# Altium schematic sheet TOP.SchDoc
size A4
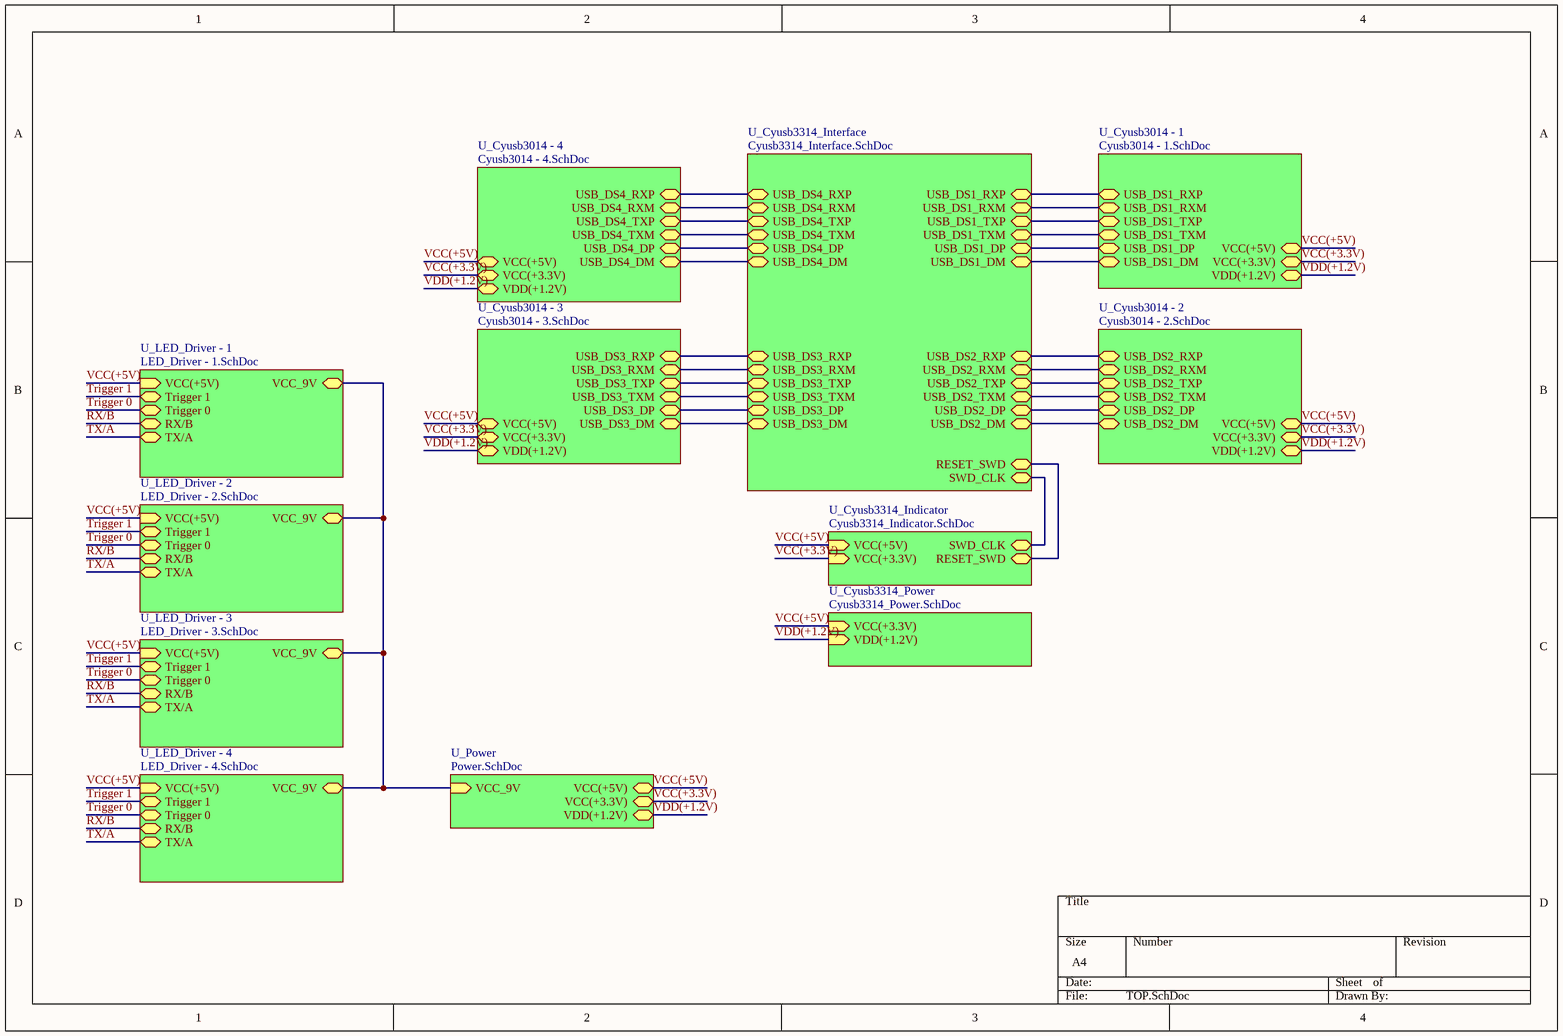
[diagram p0: TOP.SchDoc]

## Sub-sheets
U_Cyusb3014 - 1 = Cyusb3014 - 1.SchDoc: USB_DS1_RXP (bidir), USB_DS1_RXM (bidir), USB_DS1_TXP (bidir), USB_DS1_TXM (bidir), USB_DS1_DP (bidir), USB_DS1_DM (bidir), VCC(+5V) (bidir), VCC(+3.3V) (bidir), VDD(+1.2V) (bidir)
U_Cyusb3014 - 2 = Cyusb3014 - 2.SchDoc: USB_DS2_RXP (bidir), USB_DS2_RXM (bidir), USB_DS2_TXP (bidir), USB_DS2_TXM (bidir), USB_DS2_DP (bidir), USB_DS2_DM (bidir), VCC(+5V) (bidir), VCC(+3.3V) (bidir), VDD(+1.2V) (bidir)
U_Cyusb3014 - 3 = Cyusb3014 - 3.SchDoc: USB_DS3_RXP (bidir), USB_DS3_RXM (bidir), USB_DS3_TXP (bidir), USB_DS3_TXM (bidir), USB_DS3_DP (bidir), USB_DS3_DM (bidir), VCC(+5V) (bidir), VCC(+3.3V) (bidir), VDD(+1.2V) (bidir)
U_Cyusb3014 - 4 = Cyusb3014 - 4.SchDoc: USB_DS4_RXP (bidir), USB_DS4_RXM (bidir), USB_DS4_TXP (bidir), USB_DS4_TXM (bidir), USB_DS4_DP (bidir), USB_DS4_DM (bidir), VCC(+5V) (bidir), VCC(+3.3V) (bidir), VDD(+1.2V) (bidir)
U_Cyusb3314_Indicator = Cyusb3314_Indicator.SchDoc: SWD_CLK (bidir), RESET_SWD (bidir), VCC(+5V) (in), VCC(+3.3V) (in)
U_Cyusb3314_Interface = Cyusb3314_Interface.SchDoc: RESET_SWD (bidir), SWD_CLK (bidir), USB_DS1_RXP (bidir), USB_DS1_RXM (bidir), USB_DS1_TXP (bidir), USB_DS1_TXM (bidir), USB_DS1_DP (bidir), USB_DS1_DM (bidir), USB_DS2_RXP (bidir), USB_DS2_RXM (bidir), USB_DS2_TXP (bidir), USB_DS2_TXM (bidir), USB_DS2_DP (bidir), USB_DS2_DM (bidir), USB_DS3_RXP (bidir), USB_DS3_RXM (bidir), USB_DS3_TXP (bidir), USB_DS3_TXM (bidir), USB_DS3_DP (bidir), USB_DS3_DM (bidir), USB_DS4_RXP (bidir), USB_DS4_RXM (bidir), USB_DS4_TXP (bidir), USB_DS4_TXM (bidir), USB_DS4_DP (bidir), USB_DS4_DM (bidir)
U_Cyusb3314_Power = Cyusb3314_Power.SchDoc: VCC(+3.3V) (in), VDD(+1.2V) (in)
U_LED_Driver - 1 = LED_Driver - 1.SchDoc: VCC_9V (bidir), VCC(+5V) (in), Trigger 1 (bidir), Trigger 0 (bidir), RX/B (bidir), TX/A (bidir)
U_LED_Driver - 2 = LED_Driver - 2.SchDoc: VCC_9V (bidir), VCC(+5V) (in), Trigger 1 (bidir), Trigger 0 (bidir), RX/B (bidir), TX/A (bidir)
U_LED_Driver - 3 = LED_Driver - 3.SchDoc: VCC_9V (bidir), VCC(+5V) (in), Trigger 1 (bidir), Trigger 0 (bidir), RX/B (bidir), TX/A (bidir)
U_LED_Driver - 4 = LED_Driver - 4.SchDoc: VCC_9V (bidir), VCC(+5V) (in), Trigger 1 (bidir), Trigger 0 (bidir), RX/B (bidir), TX/A (bidir)
U_Power = Power.SchDoc: VCC_9V (in), VCC(+5V) (bidir), VCC(+3.3V) (bidir), VDD(+1.2V) (bidir)

## Nets
RX/B: sheet U_LED_Driver - 1/RX/B, sheet U_LED_Driver - 2/RX/B, sheet U_LED_Driver - 3/RX/B, sheet U_LED_Driver - 4/RX/B
Trigger 0: sheet U_LED_Driver - 1/Trigger 0, sheet U_LED_Driver - 2/Trigger 0, sheet U_LED_Driver - 3/Trigger 0, sheet U_LED_Driver - 4/Trigger 0
Trigger 1: sheet U_LED_Driver - 1/Trigger 1, sheet U_LED_Driver - 2/Trigger 1, sheet U_LED_Driver - 3/Trigger 1, sheet U_LED_Driver - 4/Trigger 1
TX/A: sheet U_LED_Driver - 1/TX/A, sheet U_LED_Driver - 2/TX/A, sheet U_LED_Driver - 3/TX/A, sheet U_LED_Driver - 4/TX/A
VCC(+3.3V): sheet U_Power/VCC(+3.3V), sheet U_Cyusb3014 - 1/VCC(+3.3V), sheet U_Cyusb3014 - 2/VCC(+3.3V), sheet U_Cyusb3014 - 3/VCC(+3.3V), sheet U_Cyusb3014 - 4/VCC(+3.3V), sheet U_Cyusb3314_Indicator/VCC(+3.3V)
VCC(+5V): sheet U_Power/VCC(+5V), sheet U_Cyusb3014 - 1/VCC(+5V), sheet U_Cyusb3014 - 2/VCC(+5V), sheet U_Cyusb3014 - 3/VCC(+5V), sheet U_Cyusb3014 - 4/VCC(+5V), sheet U_Cyusb3314_Indicator/VCC(+5V), sheet U_Cyusb3314_Power/VCC(+3.3V), sheet U_LED_Driver - 1/VCC(+5V), sheet U_LED_Driver - 2/VCC(+5V), sheet U_LED_Driver - 3/VCC(+5V), sheet U_LED_Driver - 4/VCC(+5V)
VDD(+1.2V): sheet U_Power/VDD(+1.2V), sheet U_Cyusb3014 - 1/VDD(+1.2V), sheet U_Cyusb3014 - 2/VDD(+1.2V), sheet U_Cyusb3014 - 3/VDD(+1.2V), sheet U_Cyusb3014 - 4/VDD(+1.2V), sheet U_Cyusb3314_Power/VDD(+1.2V)
(unnamed): sheet U_Power/VCC_9V, sheet U_LED_Driver - 1/VCC_9V, sheet U_LED_Driver - 2/VCC_9V, sheet U_LED_Driver - 3/VCC_9V, sheet U_LED_Driver - 4/VCC_9V
(unnamed): sheet U_Cyusb3014 - 1/USB_DS1_RXP, sheet U_Cyusb3314_Interface/USB_DS1_RXP
(unnamed): sheet U_Cyusb3014 - 1/USB_DS1_RXM, sheet U_Cyusb3314_Interface/USB_DS1_RXM
(unnamed): sheet U_Cyusb3014 - 1/USB_DS1_TXP, sheet U_Cyusb3314_Interface/USB_DS1_TXP
(unnamed): sheet U_Cyusb3014 - 1/USB_DS1_TXM, sheet U_Cyusb3314_Interface/USB_DS1_TXM
(unnamed): sheet U_Cyusb3014 - 1/USB_DS1_DP, sheet U_Cyusb3314_Interface/USB_DS1_DP
(unnamed): sheet U_Cyusb3014 - 1/USB_DS1_DM, sheet U_Cyusb3314_Interface/USB_DS1_DM
(unnamed): sheet U_Cyusb3014 - 2/USB_DS2_RXP, sheet U_Cyusb3314_Interface/USB_DS2_RXP
(unnamed): sheet U_Cyusb3014 - 2/USB_DS2_RXM, sheet U_Cyusb3314_Interface/USB_DS2_RXM
(unnamed): sheet U_Cyusb3014 - 2/USB_DS2_TXP, sheet U_Cyusb3314_Interface/USB_DS2_TXP
(unnamed): sheet U_Cyusb3014 - 2/USB_DS2_TXM, sheet U_Cyusb3314_Interface/USB_DS2_TXM
(unnamed): sheet U_Cyusb3014 - 2/USB_DS2_DP, sheet U_Cyusb3314_Interface/USB_DS2_DP
(unnamed): sheet U_Cyusb3014 - 2/USB_DS2_DM, sheet U_Cyusb3314_Interface/USB_DS2_DM
(unnamed): sheet U_Cyusb3014 - 3/USB_DS3_RXP, sheet U_Cyusb3314_Interface/USB_DS3_RXP
(unnamed): sheet U_Cyusb3014 - 3/USB_DS3_RXM, sheet U_Cyusb3314_Interface/USB_DS3_RXM
(unnamed): sheet U_Cyusb3014 - 3/USB_DS3_TXP, sheet U_Cyusb3314_Interface/USB_DS3_TXP
(unnamed): sheet U_Cyusb3014 - 3/USB_DS3_TXM, sheet U_Cyusb3314_Interface/USB_DS3_TXM
(unnamed): sheet U_Cyusb3014 - 3/USB_DS3_DP, sheet U_Cyusb3314_Interface/USB_DS3_DP
(unnamed): sheet U_Cyusb3014 - 3/USB_DS3_DM, sheet U_Cyusb3314_Interface/USB_DS3_DM
(unnamed): sheet U_Cyusb3014 - 4/USB_DS4_RXP, sheet U_Cyusb3314_Interface/USB_DS4_RXP
(unnamed): sheet U_Cyusb3014 - 4/USB_DS4_RXM, sheet U_Cyusb3314_Interface/USB_DS4_RXM
(unnamed): sheet U_Cyusb3014 - 4/USB_DS4_TXP, sheet U_Cyusb3314_Interface/USB_DS4_TXP
(unnamed): sheet U_Cyusb3014 - 4/USB_DS4_TXM, sheet U_Cyusb3314_Interface/USB_DS4_TXM
(unnamed): sheet U_Cyusb3014 - 4/USB_DS4_DP, sheet U_Cyusb3314_Interface/USB_DS4_DP
(unnamed): sheet U_Cyusb3014 - 4/USB_DS4_DM, sheet U_Cyusb3314_Interface/USB_DS4_DM
(unnamed): sheet U_Cyusb3314_Indicator/SWD_CLK, sheet U_Cyusb3314_Interface/SWD_CLK
(unnamed): sheet U_Cyusb3314_Indicator/RESET_SWD, sheet U_Cyusb3314_Interface/RESET_SWD